# Altium schematic sheet trinamic_board.SchDoc
size A4; SheetNumber: 8; SheetTotal: 8
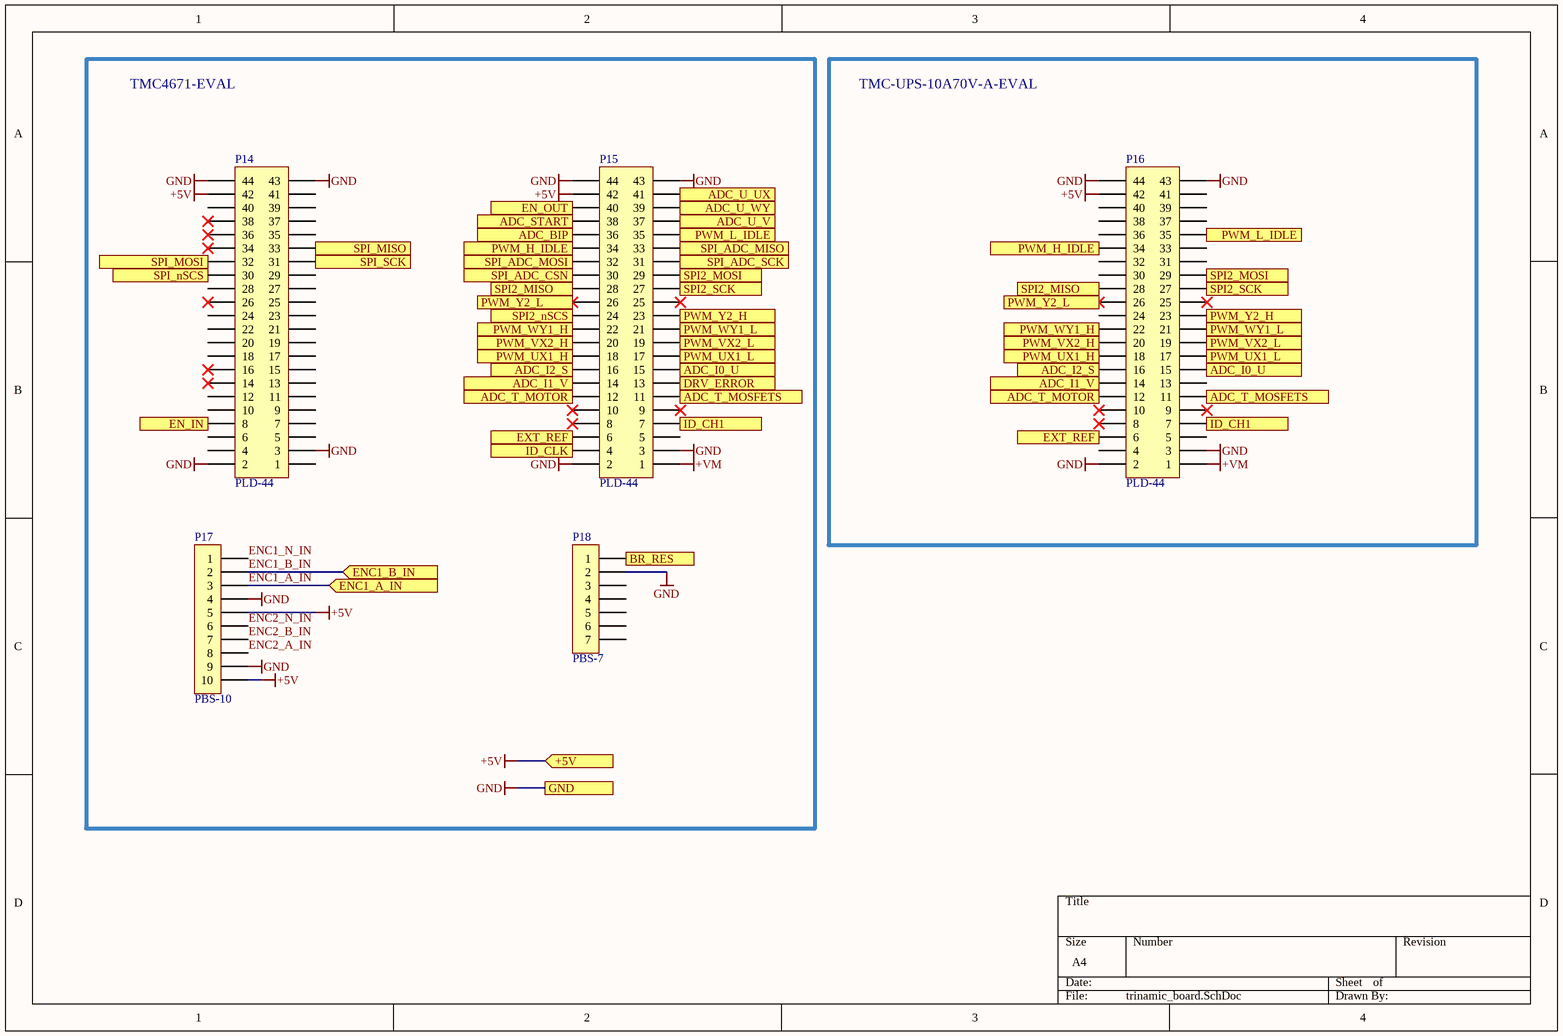
[diagram p0: trinamic_board.SchDoc]

## Parts
P14  PLD-44  [PLD-44]
P15  PLD-44  [PLD-44]
P16  PLD-44  [PLD-44]
P17  PBS-10  [PBS-10]
P18  PBS-7  [PBS-7]

## Blocks framed on the sheet
TMC4671-EVAL: P14 P15 P17 P18
TMC-UPS-10A70V-A-EVAL: P16

## Ports
+5V (in), ADC_BIP, ADC_I0_U, ADC_I1_V, ADC_I2_S, ADC_START, ADC_T_MOSFETS, ADC_T_MOTOR, ADC_U_UX, ADC_U_V, ADC_U_WY, BR_RES (out), DRV_ERROR, EN_IN (in), EN_OUT, ENC1_A_IN (in), ENC1_B_IN (in), EXT_REF, GND, ID_CH1, ID_CLK, PWM_H_IDLE, PWM_L_IDLE, PWM_UX1_H, PWM_UX1_L, PWM_VX2_H, PWM_VX2_L, PWM_WY1_H, PWM_WY1_L, PWM_Y2_H, PWM_Y2_L, SPI2_MISO, SPI2_MOSI, SPI2_nSCS, SPI2_SCK, SPI_ADC_CSN, SPI_ADC_MISO, SPI_ADC_MOSI, SPI_ADC_SCK, SPI_MISO (out), SPI_MOSI (in), SPI_nSCS (in), SPI_SCK (in)

## Nets
+5V: P14.42 P15.42 P16.42 P17.5 P17.10 ; port +5V
+VM: P15.1 P16.1
GND: P14.2 P14.3 P14.43 P14.44 P15.2 P15.3 P15.43 P15.44 P16.2 P16.3 P16.43 P16.44 P17.4 P17.9 P18.2 ; port GND
ADC_BIP: P15.36 ; port ADC_BIP
ADC_I0_U: P15.15 P16.15 ; port ADC_I0_U
ADC_I1_V: P15.14 P16.14 ; port ADC_I1_V
ADC_I2_S: P15.16 P16.16 ; port ADC_I2_S
ADC_START: P15.38 ; port ADC_START
ADC_T_MOSFETS: P15.11 P16.11 ; port ADC_T_MOSFETS
ADC_T_MOTOR: P15.12 P16.12 ; port ADC_T_MOTOR
ADC_U_UX: P15.41 ; port ADC_U_UX
ADC_U_V: P15.37 ; port ADC_U_V
ADC_U_WY: P15.39 ; port ADC_U_WY
BR_RES: P18.1 ; port BR_RES
DRV_ERROR: P15.13 ; port DRV_ERROR
EN_IN: P14.8 ; port EN_IN
EN_OUT: P15.40 ; port EN_OUT
ENC1_A_IN: P17.3 ; port ENC1_A_IN
ENC1_B_IN: P17.2 ; port ENC1_B_IN
ENC1_N_IN: P17.1
ENC2_A_IN: P17.8
ENC2_B_IN: P17.7
ENC2_N_IN: P17.6
EXT_REF: P15.6 P16.6 ; port EXT_REF
ID_CH1: P15.7 P16.7 ; port ID_CH1
ID_CLK: P15.4 ; port ID_CLK
PWM_H_IDLE: P15.34 P16.34 ; port PWM_H_IDLE
PWM_L_IDLE: P15.35 P16.35 ; port PWM_L_IDLE
PWM_UX1_H: P15.18 P16.18 ; port PWM_UX1_H
PWM_UX1_L: P15.17 P16.17 ; port PWM_UX1_L
PWM_VX2_H: P15.20 P16.20 ; port PWM_VX2_H
PWM_VX2_L: P15.19 P16.19 ; port PWM_VX2_L
PWM_WY1_H: P15.22 P16.22 ; port PWM_WY1_H
PWM_WY1_L: P15.21 P16.21 ; port PWM_WY1_L
PWM_Y2_H: P15.23 P16.23 ; port PWM_Y2_H
PWM_Y2_L: P15.26 P16.26 ; port PWM_Y2_L
SPI2_MISO: P15.28 P16.28 ; port SPI2_MISO
SPI2_MOSI: P15.29 P16.29 ; port SPI2_MOSI
SPI2_nSCS: P15.24 ; port SPI2_nSCS
SPI2_SCK: P15.27 P16.27 ; port SPI2_SCK
SPI_ADC_CSN: P15.30 ; port SPI_ADC_CSN
SPI_ADC_MISO: P15.33 ; port SPI_ADC_MISO
SPI_ADC_MOSI: P15.32 ; port SPI_ADC_MOSI
SPI_ADC_SCK: P15.31 ; port SPI_ADC_SCK
SPI_MISO: P14.33 ; port SPI_MISO
SPI_MOSI: P14.32 ; port SPI_MOSI
SPI_nSCS: P14.30 ; port SPI_nSCS
SPI_SCK: P14.31 ; port SPI_SCK

Not connected (* = marked no-connect by the designer): P14 1 4 5 6 7 9 10 11 12 13 14* 15 16* 17 18 19 20 21 22 23 24 25 26* 27 28 29 34* 35 36* 37 38* 39 40 41; P15 5 8* 9* 10* 25*; P16 4 5 8* 9* 10* 13 24 25* 30 31 32 33 36 37 38 39 40 41; P18 3 4 5 6 7

## Library data of the parts
P14-P16 = PLD-44: Разъем штыревой на плату (папа); Производитель: Connfly electronic (Zhenqin); Номинал: 1А; Напряжение: 300В; Вид монтажа: DIP; Температурный диапазон: -55…140; Примечание: шаг 2.54 мм; Название: PLD-44; Артикул: PLD-44; Тип элемента: Разъем
P17 = PBS-10: Гнездо на плату; Производитель: Connfly electronic (Zhenqin); Номинал: 1А; Напряжение: 300В; Вид монтажа: DIP; Тип элемента: Разъем; Температурный диапазон: -55…140; Примечание: шаг 2.54 мм; Название: PBS-10; Артикул: PBS-10
P18 = PBS-7: Гнездо на плату; Производитель: Connfly electronic (Zhenqin); Номинал: 1А; Напряжение: 300В; Вид монтажа: DIP; Тип элемента: Разъем; Температурный диапазон: -55…140; Примечание: шаг 2.54 мм; Название: PBS-7; Артикул: PBS-7